# EasyEDA Pro project usb2can.epro

# Schematic schematic1
Board Name: Board1; Create Date: 2024-03-06; Page Name: P1; Project Name: USB转CAN工具; Schematic Name: schematic1; Update Date: 2024-03-06
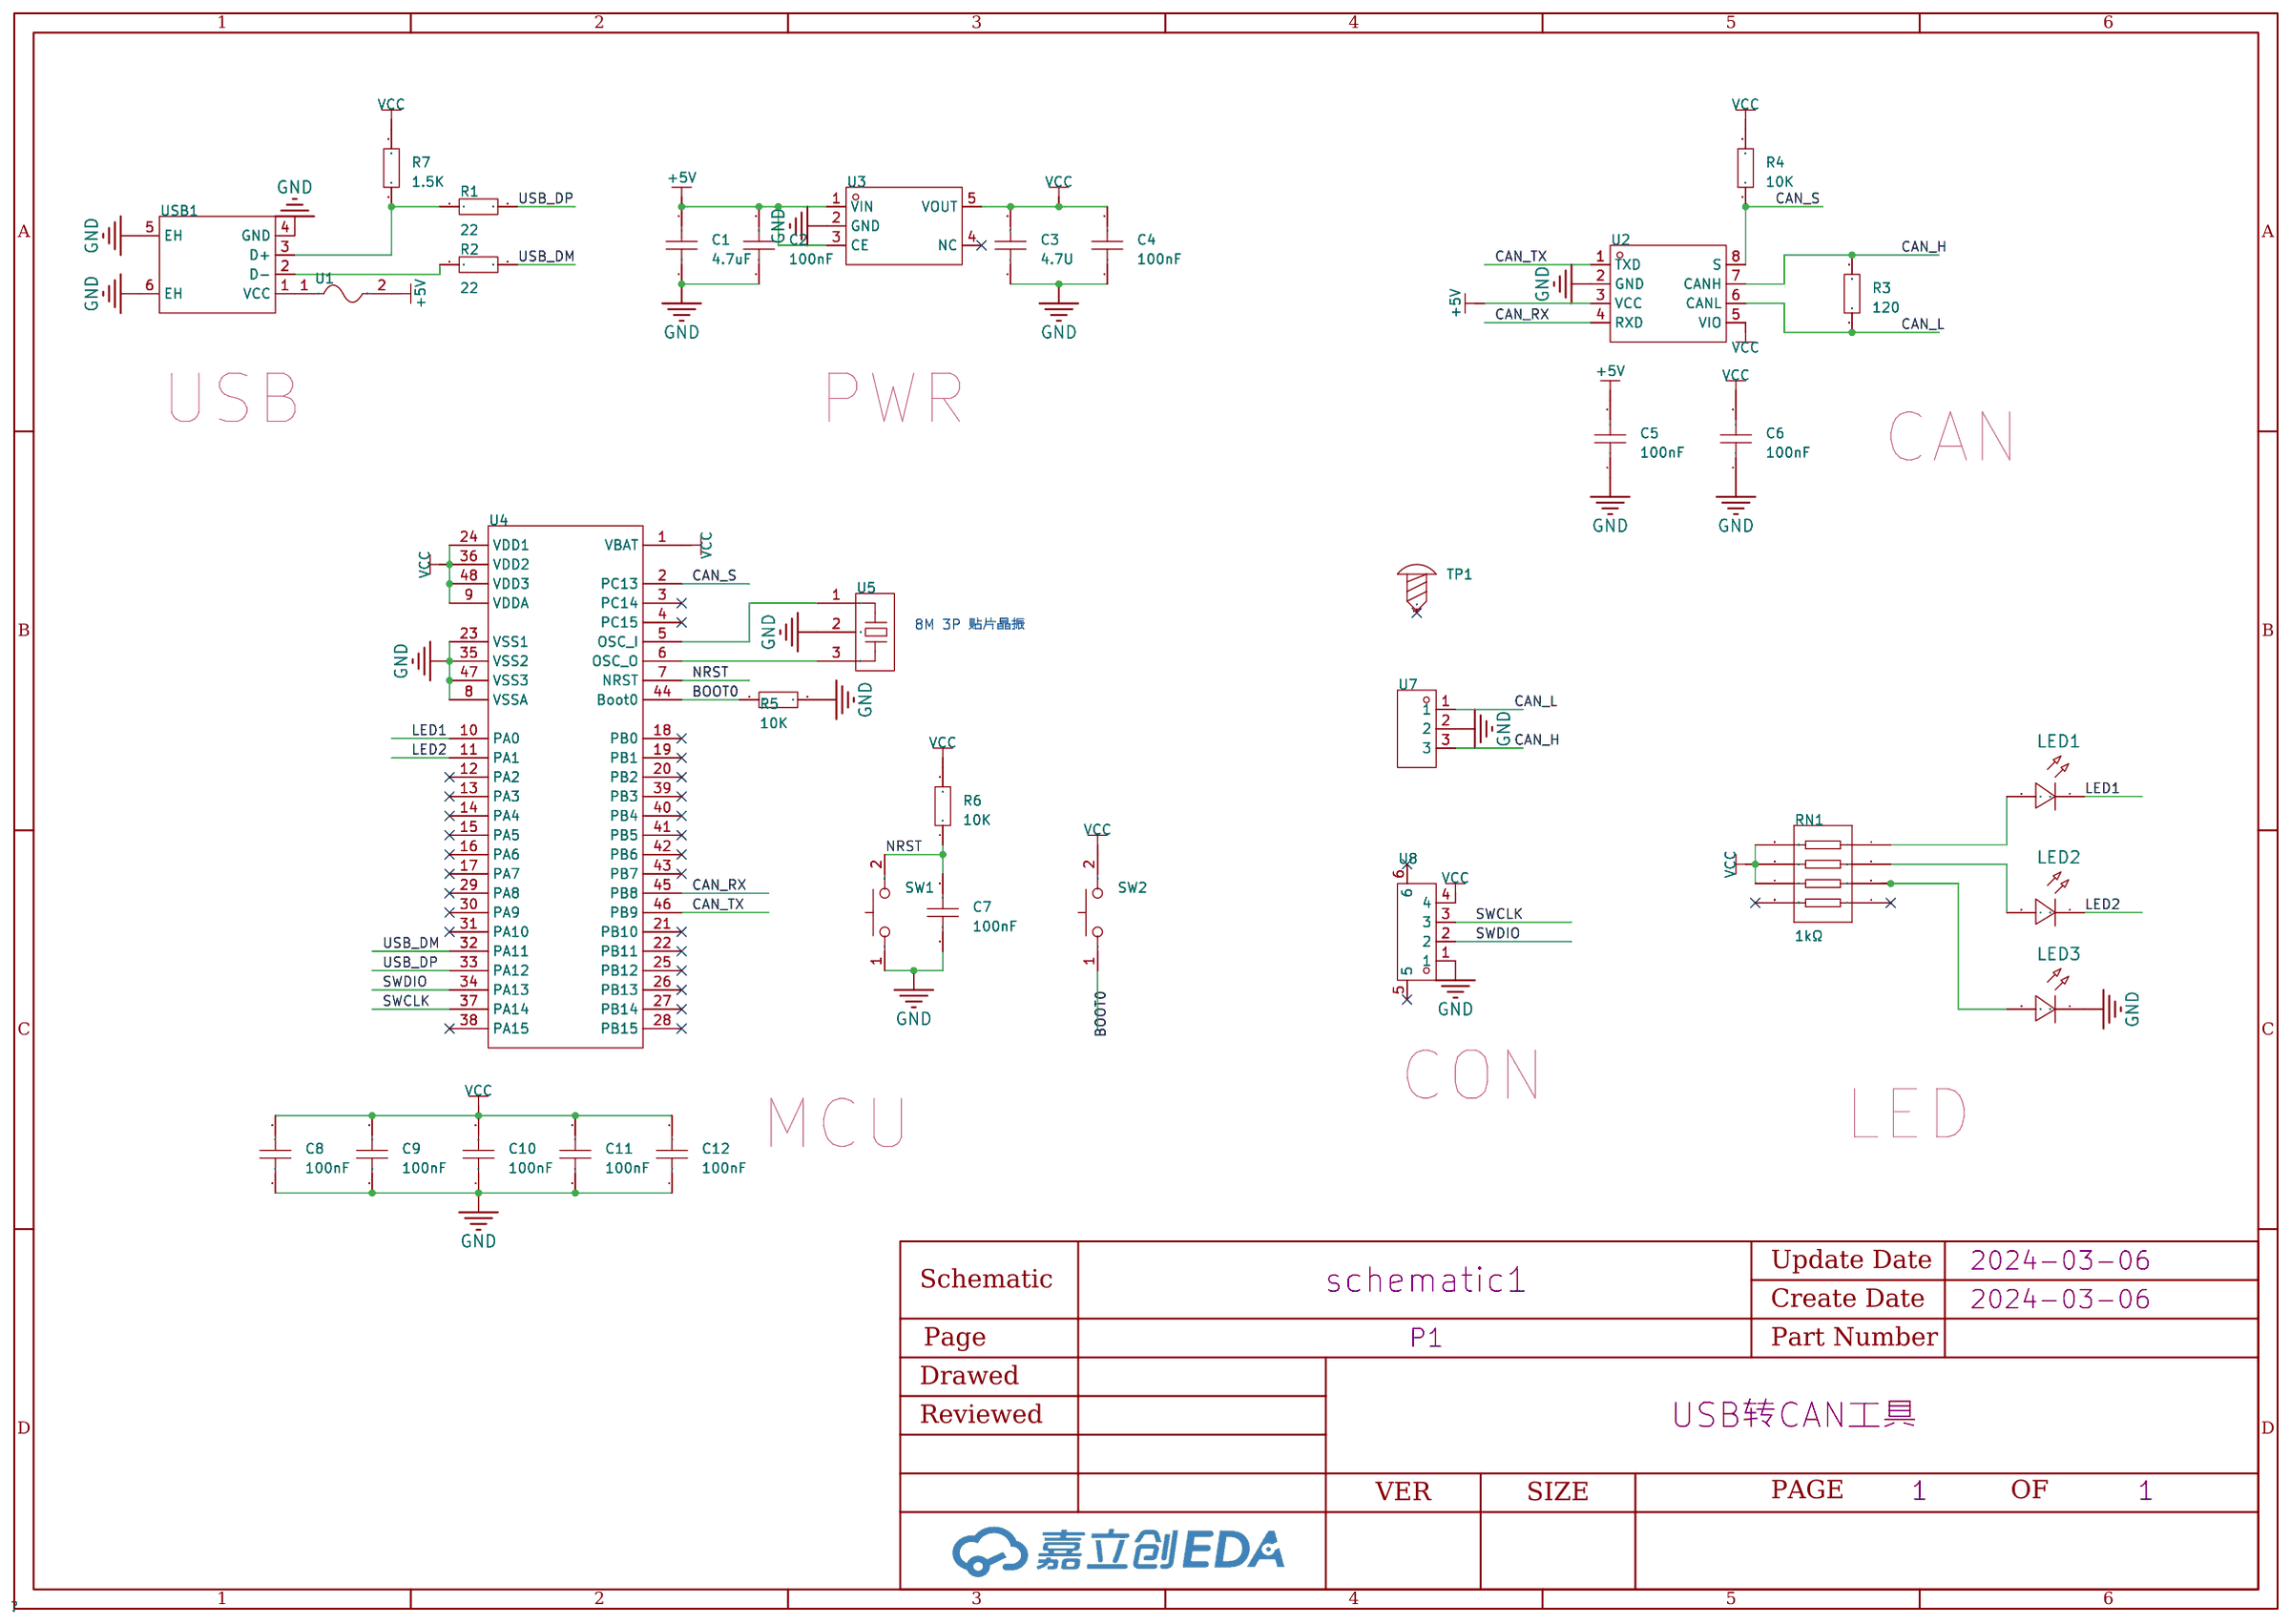
[diagram p0: schematic sheet]

## Parts
C1  4.7uF  [C0603]
C2  100nF  [C0402-S]
C3  4.7U  [C0603]
C4  100nF  [C0402-S]
C5  100nF  [C0402-S]
C6  100nF  [C0402-S]
C7  100nF  [C0402-S]
C8  100nF  [C0402-S]
C9  100nF  [C0402-S]
C10  100nF  [C0402-S]
C11  100nF  [C0402-S]
C12  100nF  [C0402-S]
LED1  -  [LED_0402]
LED2  -  [LED_0402]
LED3  -  [LED_0402]
R1  22  [R0402-S]
R2  22  [R0402-S]
R3  120  [R0402-S]
R4  10K  [R0402-S]
R5  10K  [R0402-S]
R6  10K  [R0402-S]
R7  1.5K  [R0402-S]
RN1  1kΩ  [RES-ARRAY-SMD_0804-8P-L2.0-W1.0-BL]
SW1  SKRKAEE020  [SW-SMD_L3.9-W3.0-P4.45]
SW2  SKRKAEE020  [SW-SMD_L3.9-W3.0-P4.45]
TP1  -  [M3螺丝]
U1  MF-PSMF020X-2  [F0805]
U2  TJA1051T/3  [SOP-8_L4.9-W3.9-P1.27-LS6.0-BL-1]
U3  TPRT9013-33GB  [SOT-23-5_L3.0-W1.7-P0.95-LS2.8-BL]
U4  STM32F072C8T6  [LQFP-48_L7.0-W7.0-P0.50-LS9.0-BL]
U5  CSTCE8M0V53-R0  [OSC-SMD_3P-L3.2-W1.3-P1.2-L]
U7  KF350-3.5-3P  [CONN-TH_3P-P3.50_KF350-3.5-3P]
U8  SH1.0-4P  [CONN-SMD_4P-P1.00_SH1.0-4P]
USB1  480370001  [USB-A-TH_48037-0001]

## Library data of the parts
C1 C4 = CAP_0603: Supplier Footprint: 0603
C2 C3 C5-C12 = CAP_0402: Supplier Footprint: 0402
LED1-LED3 = LED_0402-R: Supplier Footprint: 0402
R1-R7 = Res_0402: Supplier Footprint: 0402
RN1 = YC124-JR-071KL: 阻值:1kΩ;精度:±5%;单个元件功率:62.5mW;温度系数:±200ppm/℃;电阻器数:4;引脚数:8;; LCSC Part Name: 1kΩ ±5%; Supplier Part: C326869; Manufacturer: YAGEO(国巨); Supplier Footprint: 0402x4; JLCPCB Part Class: Extended Part; Datasheet: https://atta.szlcsc.com/upload/public/pdf/source/20181031/C326869_C8B113A8CFF0517934C636AB0D29A6BD.pdf; Supplier: LCSC; Tolerance: ±5%; Power(Watts): 62.5mW; Temperature Coefficient: ±200ppm/℃; Number of Resistors: 4; Number of Pins: 8
SW1 SW2 = SKRKAEE020: 触点电流:50mA;额定电压(DC):12V;电路结构:单刀单掷;按钮作用方向:顶部触动;致动器样式:圆形按钮;照明颜色:-;开关长度:3.9mm;开关宽度:2.9mm;开关高度:2mm;; LCSC Part Name: 3.9*2.9*2，1.57N; Supplier Part: C115357; Manufacturer: ALPSALPINE(阿尔卑斯阿尔派); Supplier Footprint: SMD; JLCPCB Part Class: Extended Part; Datasheet: https://atta.szlcsc.com/upload/public/pdf/source/20170620/1497944814772.pdf; Supplier: LCSC; Contact Current: 50mA; Voltage Rating (DC): 12V; Circuit: 单刀单掷; Actuator Orientation: 顶部触动; Actuator Style: 圆形按钮; Switch Length: 3.9mm; Switch Width: 2.9mm; Switch Height: 2mm
TP1 = M3螺丝: Supplier Footprint: 插件; JLCPCB Part Class: 扩展库
U1 = MF-PSMF020X-2: 最大电压:9V;最大电流:40A;保持电流:200mA;跳闸电流:500mA;初始态阻值(最小值):3.5Ω;跳断后阻值(最大值):650mΩ;最大动作时间:20ms;工作温度:-40℃~+85℃;; LCSC Part Name: 0.2A 9V 自恢复保险丝; Supplier Part: C89657; Manufacturer: BOURNS; Supplier Footprint: 0805; JLCPCB Part Class: Extended Part; Datasheet: https://atta.szlcsc.com/upload/public/pdf/source/20161125/1480068355658.pdf; Supplier: LCSC; Operating Voltage (Max): 9V; Current Rating (Max): 40A; Hold Current: 200mA; Trip Current: 500mA; Resistance - Initial (Ri) (Min): 3.5Ω; Resistance - Post Trip (R1) (Max): 650mΩ; Maximum Time to Trip: 20ms; Operating Temperature: -40℃~+85℃
U2 = TJA1051T/3: LCSC Part Name: CAN芯片; Supplier Part: C5342108; Manufacturer: Tokmas(托克马斯); Supplier Footprint: SOP-8; JLCPCB Part Class: Extended Part; Datasheet: https://atta.szlcsc.com/upload/public/pdf/source/20221230/A2F88B671123D34174A4F40D8F54A86B.pdf; Supplier: LCSC
U3 = TPRT9013-33GB: 输出类型:-;; Supplier Part: C587158; Manufacturer: TECH PUBLIC(台舟); Supplier Footprint: SOT23-5; JLCPCB Part Class: Extended Part; Datasheet: https://atta.szlcsc.com/upload/public/pdf/source/20210810/692D4D0C3CF190F9330EFD28C3E572CB.pdf; Supplier: LCSC
U4 = STM32F072C8T6: 工作电压:1.65V ~ 3.6V;CPU内核:ARM® Cortex®-M0;; Supplier Part: C80488; Manufacturer: ST(意法半导体); Supplier Footprint: LQFP-48_7x7x05P; JLCPCB Part Class: Extended Part; Datasheet: https://atta.szlcsc.com/upload/public/pdf/source/20160816/1471343013459.pdf; Supplier: LCSC; Features: I2S,HDMI CEC; UART/USART: 4 USART; USB Device: 1; PWM: 6; I2C（SMBUS/PMBUS）: 2; Voltage - Supply (Vcc/Vdd): 1.65V ~ 3.6V; CAN: 1; A/D: 10x12bit; D/A: 2x12bit; Core Processor: ARM® Cortex®-M0; Program Memory Size: 64KB; RAM Size: 16KB; Number of I/O: 37
U5 = CSTCE8M0V53-R0: Supplier Part: C2859132; Supplier Footprint: SMD-3_3215; JLCPCB Part Class: Extended Part; Datasheet: 2021-07-27/124175A/e424ab94b60540df879fb6ebe141dcef/CSTLS4M00G53-B0.PDF; Supplier: LCSC
U7 = KF350-3.5-3P: 间距:3.5mm;排数:1;每排PIN数:3;安装方式:直针;额定电流:10A;额定电压:300V;线规 - AWG:18~24;线规 - mm2:0.75;工作温度范围:-40℃~+105℃;颜色:绿色;; LCSC Part Name: 3.5mm 排数:1 每排P数:3 直针 可拼接 铜 环保; Supplier Part: C474893; Manufacturer: KEFA(科发); Supplier Footprint: 插件,P=3.5mm; JLCPCB Part Class: Extended Part; Datasheet: https://atta.szlcsc.com/upload/public/pdf/source/20230317/986DB56DD49619EA586AA8816AA9D164.pdf; Supplier: LCSC; Pitch: 3.5mm; Number of Rows: 1; Number of PINs Per Row: 3; Mounting Style: 直针; Current Rating (Max): 10A; Voltage Rating (Max): 300V; Wire Gauge - AWG: 18~24; Wire Gauge - mm2: 0.75; Operating Temperature Range: -40℃~+105℃; Color: 绿色
U8 = SH1.0-4P: Supplier Part: C9900023784; Supplier Footprint: CONN-SMD-4P; JLCPCB Part Class: Extended Part; Supplier: LCSC
USB1 = 480370001: 连接器类型:Type-A;标准:USB 2;公母:公头;触点数量:4;端口数量:1;; LCSC Part Name: 48037-0001; Supplier Part: C136455; Manufacturer: MOLEX; Supplier Footprint: 插件; JLCPCB Part Class: Extended Part; Datasheet: https://atta.szlcsc.com/upload/public/pdf/source/20171113/C136455_15105610941911115480.pdf; Supplier: LCSC; Connector Type: Type-A; Standard: USB 2; Gender: 公头; Number of Contacts: 4; Number of Ports: 1

## Nets
+5V: C1.2 C2.2 C5.2 U1.2 U2.3(VCC) U3.1(VIN) U3.3(CE)
GND: C1.1 C2.1 C3.1 C4.1 C5.1 C6.1 C7.1 C8.1 C9.1 C10.1 C11.1 C12.1 LED3.1(C) R5.2 SW1.1 U2.2(GND) U3.2(GND) U4.8(VSSA) U4.23(VSS1) U4.35(VSS2) U4.47(VSS3) U5.2 U7.2 U8.1 USB1.4(GND) USB1.5(EH) USB1.6(EH)
VCC: C3.2 C4.2 C6.2 C8.2 C9.2 C10.2 C11.2 C12.2 R4.2 R6.2 R7.2 RN1.5 RN1.6 RN1.7 SW2.2 U2.5(VIO) U3.5(VOUT) U4.1(VBAT) U4.9(VDDA) U4.24(VDD1) U4.36(VDD2) U4.48(VDD3) U8.4
BOOT0: R5.1 SW2.1 U4.44(Boot0)
CAN_H: R3.2 U2.7(CANH) U7.3
CAN_L: R3.1 U2.6(CANL) U7.1
CAN_RX: U2.4(RXD) U4.45(PB8)
CAN_S: R4.1 U2.8(S) U4.2(PC13)
CAN_TX: U2.1(TXD) U4.46(PB9)
LED1: LED1.1(C) U4.10(PA0)
LED2: LED2.1(C) U4.11(PA1)
NRST: C7.2 R6.1 SW1.2 U4.7(NRST)
SWCLK: U4.37(PA14) U8.3
SWDIO: U4.34(PA13) U8.2
USB_DM: R2.2 U4.32(PA11)
USB_DP: R1.2 U4.33(PA12)
$1N464: U1.1 USB1.1(VCC)
$1N624: R1.1 R7.1 USB1.3(D+)
$1N628: R2.1 USB1.2(D-)
$1N1992: U4.5(OSC_I) U5.1
$1N1996: U4.6(OSC_O) U5.3
$1N2822: LED1.2(A) RN1.4
$1N2923: LED2.2(A) RN1.3
$1N2978: LED3.2(A) RN1.2

Not connected (* = marked no-connect by the designer): RN1 1* 8*; TP1 1*; U3 4(NC)*; U4 3(PC14)* 4(PC15)* 12(PA2)* 13(PA3)* 14(PA4)* 15(PA5)* 16(PA6)* 17(PA7)* 18(PB0)* 19(PB1)* 20(PB2)* 21(PB10)* 22(PB11)* 25(PB12)* 26(PB13)* 27(PB14)* 28(PB15)* 29(PA8)* 30(PA9)* 31(PA10)* 38(PA15)* 39(PB3)* 40(PB4)* 41(PB5)* 42(PB6)* 43(PB7)*; U8 5* 6*

## Notes on the sheet
- USB
- PWR
- CAN
- 8M 3P 贴片晶振
- CON
- MCU
- LED

# Board PCB1
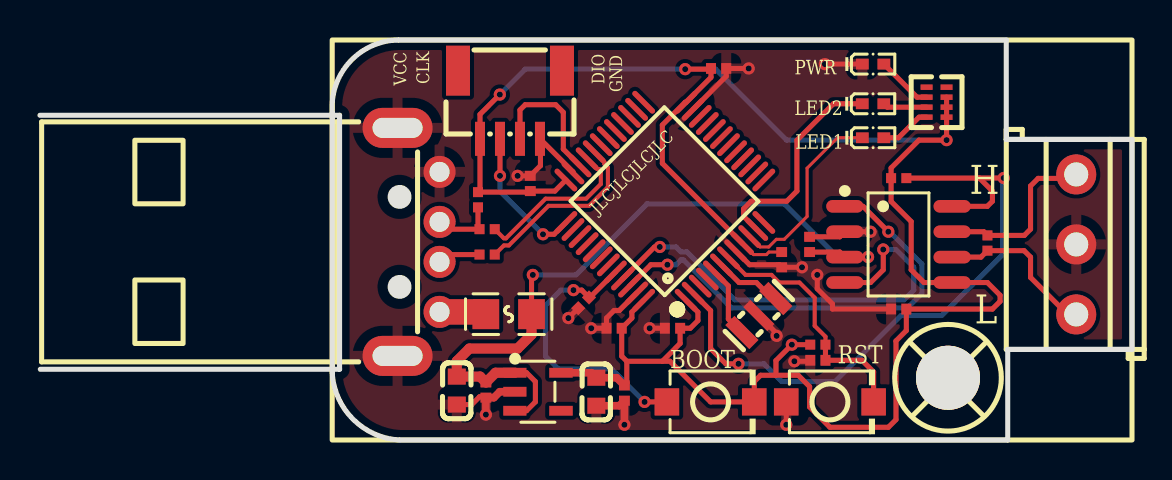
[diagram p1: board, top side]
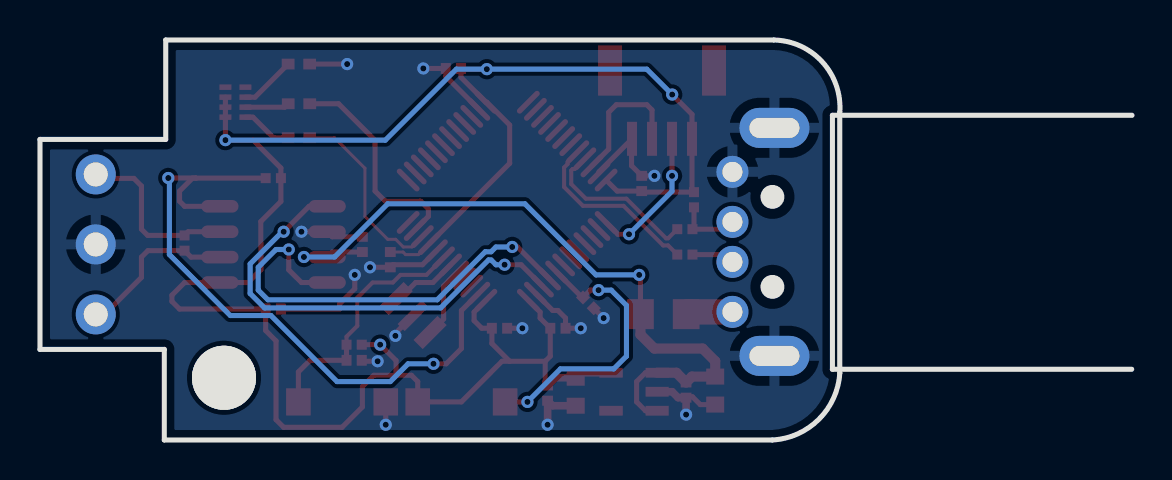
[diagram p2: board, bottom side, seen from below]

Outline 54.62 x 20 mm; copper layers: Top Layer, Bottom Layer. Coordinates in mm from the lower left corner of the outline.
Outline path: 14.62,16.38 14.62,3.35 arc(15.67,1.03) 18,0 48.4,0 48.4,4.53 54.62,4.53 54.62,15.03 48.33,15.03 48.33,20 17.92,20 arc(15.49,18.9) 14.62,16.38
Stack: Top Layer 0.035mm / Dielectric1 1.51mm FR4 er 4.5 / Bottom Layer 0.035mm

## Design rules (mm)
template: JLCPCB Capability(Two Layers Board)
spacing copperThickness1oz (default): track to track 0.102, other pairs 0.152 to 0.3
spacing copperThickness2oz: track to track 0.203, other pairs 0.152 to 0.3
track width copperThickness1oz (default): min 0.127, default 0.254, max 2.54
track width copperThickness2oz: min 0.203, default 0.254, max 2.54
differential pair differentialPair (default): width min 0.127, default 0.254, max 2.54; gap min 0.152, default 0.152
via viaSize (default): diameter min 0.5, default 0.61, max 10; hole min 0.3, default 0.305, max 6.3

## Placement (name value [footprint] x y rotation side)
C1  4.7uF  [C0603]  20.85 2.47 90 top
C2  100nF  [C0402-S]  22.3 2.5 90 top
C3  4.7U  [C0603]  27.82 2.41 90 top
C4  100nF  [C0402-S]  29.23 2.35 90 top
C5  100nF  [C0402-S]  38.49 9.78 270 top
C6  100nF  [C0402-S]  42.95 6.55 0 top
C7  100nF  [C0402-S]  38.9 3.98 0 top
C8  100nF  [C0402-S]  33.94 18.58 180 top
C9  100nF  [C0402-S]  37.09 9.02 90 top
C10  100nF  [C0402-S]  28.71 5.59 0 top
C11  100nF  [C0402-S]  24.52 12.83 270 top
C12  100nF  [C0402-S]  31.63 5.59 0 top
LED1  -  [LED_0402]  41.67 15.11 0 top
LED2  -  [LED_0402]  41.66 16.81 0 top
LED3  -  [LED_0402]  41.67 18.8 0 top
R1  22  [R0402-S]  22.36 10.54 0 top
R2  22  [R0402-S]  22.36 9.27 0 top
R3  120  [R0402-S]  47.39 9.85 90 top
R4  10K  [R0402-S]  42.95 13.09 180 top
R5  10K  [R0402-S]  27.19 6.86 225 top
R6  10K  [R0402-S]  38.9 4.77 180 top
R7  1.5K  [R0402-S]  21.91 12.01 90 top
RN1  1kΩ  [RES-ARRAY-SMD_0804-8P-L2.0-W1.0-BL]  44.84 16.89 270 top
SW1  SKRKAEE020  [SW-SMD_L3.9-W3.0-P4.45]  39.51 1.91 0 top
SW2  SKRKAEE020  [SW-SMD_L3.9-W3.0-P4.45]  33.54 1.91 0 top
TP1  -  [M3螺丝]  45.48 3.05 0 top
U1  MF-PSMF020X-2  [F0805]  23.44 6.29 0 top
U2  TJA1051T/3  [SOP-8_L4.9-W3.9-P1.27-LS6.0-BL-1]  42.94 9.78 270 top
U3  TPRT9013-33GB  [SOT-23-5_L3.0-W1.7-P0.95-LS2.8-BL]  24.9 2.41 270 top
U4  STM32F072C8T6  [LQFP-48_L7.0-W7.0-P0.50-LS9.0-BL]  31.25 11.94 45 top
U5  CSTCE8M0V53-R0  [OSC-SMD_3P-L3.2-W1.3-P1.2-L]  35.95 6.22 45 top
U7  KF350-3.5-3P  [CONN-TH_3P-P3.50_KF350-3.5-3P]  51.83 9.78 90 top
U8  SH1.0-4P  [CONN-SMD_4P-P1.00_SH1.0-4P]  23.51 16.76 180 top
USB1  480370001  [USB-A-TH_48037-0001]  18.93 9.91 270 top

## Footprints (pads in the part's own frame, mm; a bottom-side part is the same pattern mirrored in y, then rotated)
C0402-S
  rect 0.5x0.54 smd: 1(-0.381,0) 2(0.381,0)
C0603
  rect 0.8x0.9 smd: 1(-0.7,0) 2(0.7,0)
CONN-SMD_4P-P1.00_SH1.0-4P
  rect 0.5x1.7 smd: 1(-1.5,1.705) 2(-0.5,1.705) 3(0.5,1.705) 4(1.5,1.705)
  rect 1.2x2.5 smd: 5(-2.6,-1.705) 6(2.6,-1.705)
CONN-TH_3P-P3.50_KF350-3.5-3P
  round 2 hole 1.2: 1(-3.5,0) 2(0,0) 3(3.5,0)
F0805
  rect 1.335x1.5 smd: 1(-1.143,0) 2(1.143,0)
LED_0402
  rect 0.637x0.541 smd: 1(-0.538,0) 2(0.538,0)
LQFP-48_L7.0-W7.0-P0.50-LS9.0-BL
  oval 0.27x1.5 smd: 1(-2.75,-4.25) 2(-2.25,-4.25) 3(-1.75,-4.25) 4(-1.25,-4.25) 5(-0.75,-4.25) 6(-0.25,-4.25) 7(0.25,-4.25) 8(0.75,-4.25) 9(1.25,-4.25) 10(1.75,-4.25) 11(2.25,-4.25) 12(2.75,-4.25) 25(2.75,4.25) 26(2.25,4.25) 27(1.75,4.25) 28(1.25,4.25) 29(0.75,4.25) 30(0.25,4.25) 31(-0.25,4.25) 32(-0.75,4.25) 33(-1.25,4.25) 34(-1.75,4.25) 35(-2.25,4.25) 36(-2.75,4.25)
  oval 1.5x0.27 smd: 13(4.25,-2.75) 14(4.25,-2.25) 15(4.25,-1.75) 16(4.25,-1.25) 17(4.25,-0.75) 18(4.25,-0.25) 19(4.25,0.25) 20(4.25,0.75) 21(4.25,1.25) 22(4.25,1.75) 23(4.25,2.25) 24(4.25,2.75) 37(-4.25,2.75) 38(-4.25,2.25) 39(-4.25,1.75) 40(-4.25,1.25) 41(-4.25,0.75) 42(-4.25,0.25) 43(-4.25,-0.25) 44(-4.25,-0.75) 45(-4.25,-1.25) 46(-4.25,-1.75) 47(-4.25,-2.25) 48(-4.25,-2.75)
M3螺丝
  round 3.2 hole 3.2: 1(-0.064,0.064)
OSC-SMD_3P-L3.2-W1.3-P1.2-L
  rect 0.65x1.7 smd: 1(-1.2,0) 3(1.2,0)
  rect 0.5x1.7 smd: 2(0,0)
R0402-S
  rect 0.5x0.5 smd: 1(-0.381,0) 2(0.381,0)
RES-ARRAY-SMD_0804-8P-L2.0-W1.0-BL
  rect 0.275x0.6 smd: 1(-0.75,-0.5) 2(-0.25,-0.5) 3(0.25,-0.5) 4(0.75,-0.5) 5(0.75,0.5) 6(0.25,0.5) 7(-0.25,0.5) 8(-0.75,0.5)
SOP-8_L4.9-W3.9-P1.27-LS6.0-BL-1
  oval 0.63x1.865 smd: 1(-1.905,-2.683) 2(-0.635,-2.683) 3(0.635,-2.683) 4(1.905,-2.683) 5(1.905,2.683) 6(0.635,2.683) 7(-0.635,2.683) 8(-1.905,2.683)
SOT-23-5_L3.0-W1.7-P0.95-LS2.8-BL
  rect 0.49x1.157 smd: 1(-0.95,-1.153) 2(0,-1.153) 3(0.95,-1.153)
  rect 0.49x1.175 smd: 4(0.95,1.153) 5(-0.95,1.153)
SW-SMD_L3.9-W3.0-P4.45
  rect 1.23x1.36 smd: 1(-2.185,0) 2(2.185,0)
USB-A-TH_48037-0001
  round 1.6 hole 1: 1(3.5,1.05) 2(1,1.05) 3(-1,1.05) 4(-3.5,1.05)
  oval 2x3.5 hole 1x2.5: 5(-5.7,-1.05) 6(5.7,-1.05)

## Nets
As in the schematic.

Pads without a net: RN1 1 8; TP1 1; U3 4; U4 3 4 12 13 14 15 16 17 18 19 20 21 22 25 26 27 28 29 30 31 38 39 40 41 42 43; U8 5 6

## Via types
v1: diameter 0.61, hole 0.305, Top Layer to Bottom Layer, 30 vias

## Routing (per net, layer and track width the routed paths; a pad name or vN(x,y) marks a point on that pad's centre or on a via; arc(x,y) is an arc through that point)
+5V: length 37.1
  Top Layer w0.254: C5.2 40,9.4 U2.3 41.41,9.14 ; U1.2 24.58,8.19 v1(24.65,8.25) ; U3.3 24.33,1.46 24.78,1.91 24.78,2.92 24.33,3.36 U3.1
  Top Layer w0.508: U3.1 22.79,3.36 C2.2 22.01,3.17 C1.2 20.85,3.94 21.47,4.57 23.89,4.57 24.58,5.27 U1.2
  Bottom Layer w0.254: v1(24.65,8.25) 26.81,8.25 30.36,11.81 37.22,11.81 39.88,9.15 v1(41.42,9.15)
GND: length 37.4
  Top Layer w0.254: C5.1 40,10.16 U2.2 v1(41.54,10.41) ; U4.35 26.66,13.41 25.03,15.03 ; 29.84,7.34 28.97,6.48 28.71,6.48 28.33,6.1 C10.1 v1(27.57,5.59) ; v1(23.89,13.21) C11.1 25.03,13.72 25.03,15.03 ; 25.03,15.03 U8.1 ; U4.8 35.49,8.76 36.97,8.76 C9.1 v1(38.11,8.64) ; C7.1 38.47,3.94 v1(37.73,3.94) ; SW1.1 v1(37.32,0.76) ; C12.1 v1(30.49,5.59) ; v1(35.44,18.58) C8.1 34.32,18.19 U4.23 ; LED3.1 v1(39.25,18.8) ; U5.2 36.84,5.33 v1(36.84,5.21) ; C6.1 39.63,6.55 39.63,6.8 38.87,7.56 v1(38.87,8.25) ; C1.1 21.59,1.77 21.98,2.16 22.26,2.16 C2.1 ; R5.2 v1(26.43,6.1)
  Top Layer w0.381: v1(29.23,0.76) C4.1 28.98,1.71 C3.1 ; U3.2 23,2.41 22.7,2.12 C2.1 v1(22.3,1.27)
VCC: length 108.9
  Top Layer w0.152: C9.2 36.46,9.4 36.33,9.27 35.69,9.27 U4.9
  Top Layer w0.254: v1(32.27,18.54) 33.52,18.54 C8.2 33.56,18.13 U4.24 32.27,16.89 31.13,15.75 31.13,13.83 U4.9 ; 36.78,3.24 36.81,3.26 36.81,3.97 v1(37.6,4.77) R6.2 ; 36.78,3.24 36.04,3.24 35.72,2.92 SW2.2 33.54,1.91 31.51,3.94 31.13,3.94 ; 36.78,3.24 37.92,3.24 38.49,2.67 38.49,1.65 39.51,0.64 42.43,0.64 42.81,1.02 42.81,4.95 43.33,5.47 C6.2 47.64,6.55 48.02,6.93 48.02,7.24 47.38,7.87 U2.5 44.21,7.87 43.57,8.51 43.57,10.92 42.57,11.93 R4.2 42.57,13.6 43.96,14.99 v1(45.34,14.99) ; U4.48 29.6,6.4 29.6,6.1 C10.2 29.09,4.19 29.35,3.94 ; U4.1 32.9,6.4 32.9,5.97 32.52,5.59 C12.2 32.01,4.83 31.13,3.94 ; U4.36 25.75,12.45 C11.2 24.47,12.39 R7.2 22.01,12.49 U8.4 22.01,16.28 v1(23,17.27) ; 29.35,3.94 29.35,2.85 C4.2 ; 29.35,3.94 31.13,3.94 ; RN1.7 RN1.6 RN1.5 v1(45.34,14.99) ; v1(45.34,14.99) 45.35,14.99
  Top Layer w0.381: U3.5 27.57,3.36 C3.2 28.84,3.11 C4.2
  Bottom Layer w0.254: v1(23,17.27) 24.27,18.54 v1(32.27,18.54) 33.79,18.54 37.34,14.99 v1(45.34,14.99)
BOOT0: length 14
  Top Layer w0.254: U4.44 27.5,7.13 R5.1 27.09,7.49 v1(26.68,7.49) ; SW2.1 v1(30.24,1.91)
  Bottom Layer w0.254: v1(30.24,1.91) 28.59,3.56 25.92,3.56 25.28,4.19 25.28,6.73 26.05,7.49 v1(26.68,7.49)
CAN_H: length 8.8
  Top Layer w0.254: U7.3 51.63,13.08 49.92,13.08 49.54,12.7 49.54,10.54 49.23,10.23 R3.2 47.2,10.41 U2.7
CAN_L: length 8.3
  Top Layer w0.254: U2.6 47.06,9.14 R3.1 49.22,9.47 49.54,9.14 49.54,8.13 51.39,6.28 U7.1
CAN_RX: length 22.8
  Top Layer w0.254: v1(42.17,9.53) 42.17,8.51 41.54,7.87 U2.4 ; v1(31,9.65) 30.73,9.65 U4.45
  Bottom Layer w0.254: v1(42.17,9.53) 42.81,9.53 43.7,8.64 43.7,7.49 43.22,7.01 34.75,7.01 32.35,9.41 32.05,9.41 31.81,9.65 v1(31,9.65)
CAN_S: length 33.5
  Top Layer w0.254: U4.2 33.54,6.47 33.54,4.57 34.3,3.81 v1(34.94,3.81) ; U2.8 47.38,11.68 47.64,11.94 47.64,12.45 46.99,13.09 46.82,13.09 ; v1(48.2,13.1) 46.82,13.1 46.82,13.09 ; 46.82,13.09 R4.1
  Bottom Layer w0.254: 48.14,13.08 48.14,9.27 45.1,6.22 43.06,6.22 39.76,2.92 37.09,2.92 36.21,3.81 v1(34.94,3.81)
CAN_TX: length 23
  Top Layer w0.254: U4.46 30.55,8.76 v1(31.38,8.76) ; v1(42.43,10.41) 41.16,11.68 U2.1
  Bottom Layer w0.254: v1(42.43,10.41) 42.5,10.41 44.11,8.8 44.11,7.32 43.38,6.6 34.58,6.6 32.18,9 32.05,9 31.81,8.76 v1(31.38,8.76)
LED1: length 9.5
  Top Layer w0.152: U4.10 36.01,9.65 36.45,9.65 36.83,10.03 37.22,10.03 38.36,11.18 38.36,13.59 39.89,15.11 LED1.1
LED2: length 10.9
  Top Layer w0.254: 35.85,10.52 35.19,11.18 35.19,11.56 35.57,11.94 37.35,11.94 37.86,12.45 37.86,14.99 39.68,16.81 LED2.1
NRST: length 12.6
  Top Layer w0.203: R6.1 39.28,5.17 38.75,5.71 38.75,7.11 37.98,7.87 36.97,7.87 36.59,8.25 35.29,8.25 34.43,9.11
  Top Layer w0.254: SW1.2 41.69,3.4 41.11,3.98 C7.2 R6.1
SWCLK: length 7.1
  Top Layer w0.254: v1(25.16,10.29) 25.71,10.29 U4.37 ; U8.3 v1(23.01,13.21)
  Bottom Layer w0.254: v1(25.16,10.29) 23.01,12.44 v1(23.01,13.21)
SWDIO: length 6.9
  Top Layer w0.254: U8.2 24.01,16.5 24.27,16.76 25.79,16.76 26.17,16.38 26.17,14.54 U4.34
USB_DM: length 9.1
  Top Layer w0.203: U4.32 28.23,13.9 28.23,13.8 28.4,13.62 28.4,12.65 27.46,11.71 25.43,11.71 23.45,9.73 23.2,9.73 R2.2
USB_DP: length 8.2
  Top Layer w0.203: R1.2 23.2,10.08 23.3,10.08 25.28,12.06 27.32,12.06 28.05,12.8 28.05,13.48 27.98,13.55 27.87,13.55 U4.33
$1N464: length 2.4
  Top Layer w1.27: U1.1 22.19,6.41 USB1.1
$1N624: length 3.3
  Top Layer w0.254: USB1.3 20.35,10.54 R1.1 21.91,10.62 R7.1
$1N628: length 2.1
  Top Layer w0.254: R2.1 20.35,9.27 USB1.2
$1N1992: length 3.6
  Top Layer w0.254: U4.5 34.43,7.7 34.43,6.05 U5.1
$1N1996: length 3.4
  Top Layer w0.254: U5.3 36.63,7.07 35.82,7.87 34.96,7.87 U4.6
$1N2822: length 2.6
  Top Layer w0.254: RN1.4 43.96,16.14 42.94,15.11 LED1.2
$1N2923: length 2.2
  Top Layer w0.254: RN1.3 42.37,16.64 LED2.2
$1N2978: length 2.8
  Top Layer w0.254: RN1.2 43.86,17.14 LED3.2

## Copper pours and planes (outline as drawn; the poured copper is in the pictures)
GND on Top Layer: -1.77,20.7 54.87,20.7 54.87,-1.14 -1.77,-1.14
GND on Bottom Layer: -1.77,21.08 54.62,21.08 54.62,-1.14 -1.77,-1.14

## Text on the board
Top Silkscreen Layer: JLCJLCJLCJLC | VCC | CLK | DIO | GND | PWR | LED2 | LED1 | BOOT | RST | H | L
